# EasyEDA Pro project EasyEDA.epro, board PCB1
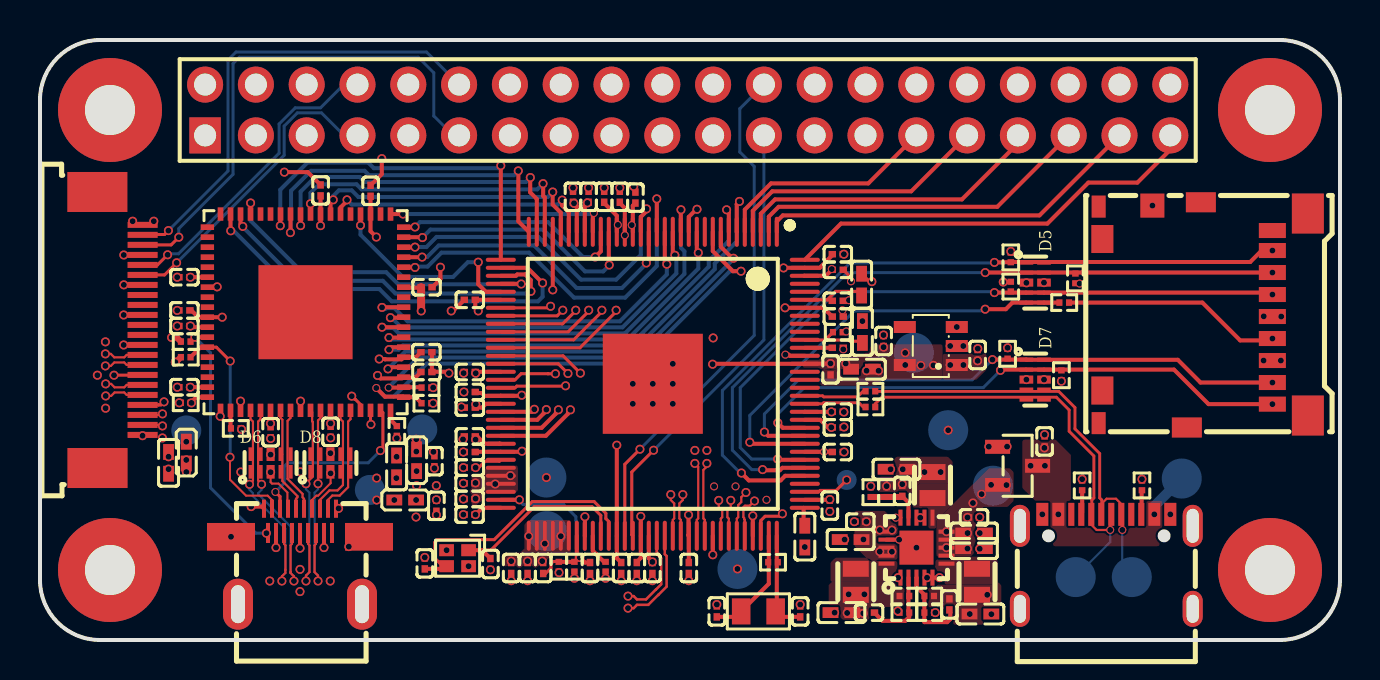
[diagram p3: board, top side]
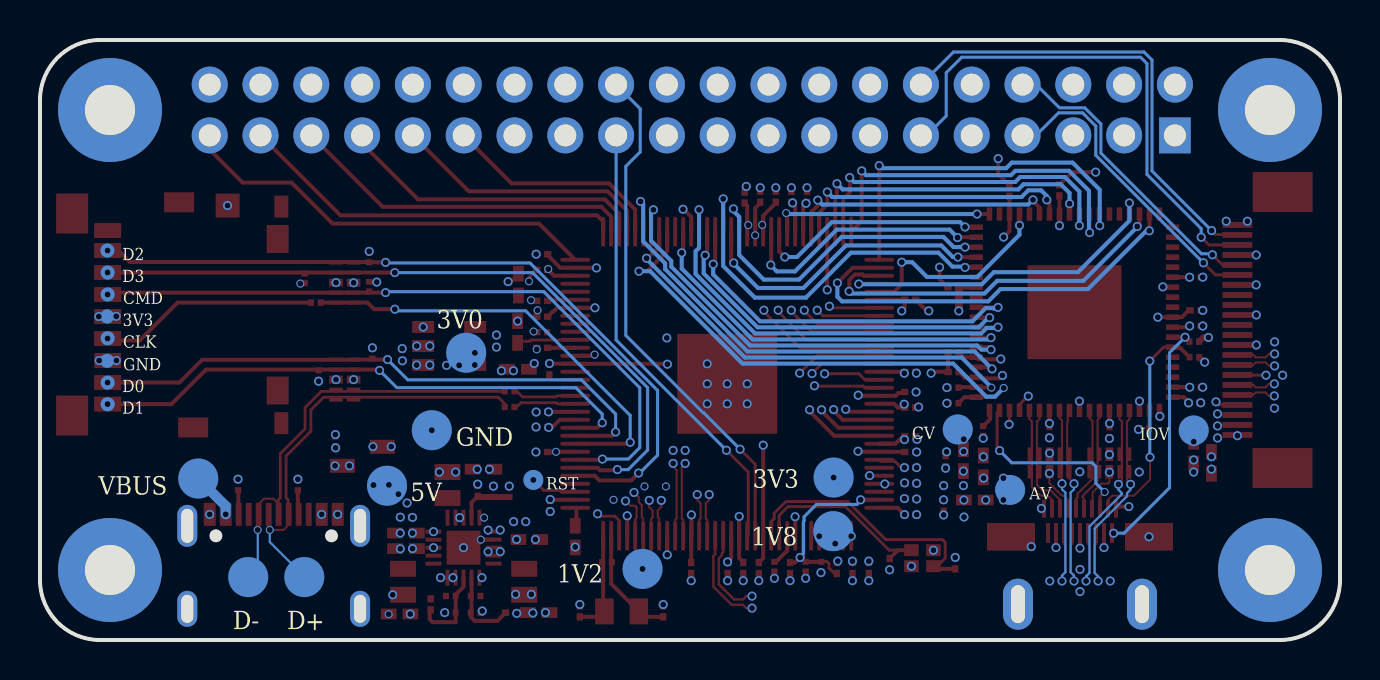
[diagram p4: board, bottom side, seen from below]

Outline 65 x 30 mm; copper layers: Top Layer, GND0, PWR, SIG, GND1, Bottom Layer. Coordinates in mm from the lower left corner of the outline.
Outline path: 0,27 0,3 arc(0.88,0.88) 3,0 62,0 arc(64.12,0.88) 65,3 65,27 arc(64.12,29.12) 62,30 3,30 arc(0.88,29.12) 0,27
Stack: Top Layer 0.035mm Outer layer thickness 1oz / Dielectric1 0.0994mm 3313 RC57% 4.2mil / GND0 0.0152mm Inner layer thickness / Dielectric2 0.55mm 0.55mm H/H No copper / PWR 0.0152mm Inner layer thickness / Dielectric3 0.1088mm 2116 RC54% 4.9mil / SIG 0.0152mm Inner layer thickness / Dielectric4 0.55mm 0.55mm H/H No copper / GND1 0.0152mm Inner layer thickness / Dielectric5 0.0994mm 3313 RC57% 4.2mil / Bottom Layer 0.035mm Outer layer thickness 1oz

## Design rules (mm)
net DP: DP2
net DM: DP2
net MCSI-CKN: DP10
net MCSI-CKP: DP10
net MCSI-D1N: DP8
net MCSI-D1P: DP8
net MCSI-D0N: DP9
net MCSI-D0P: DP9
net TXC-: DP7
net TXC+: DP7
net TX0-: DP6
net TX0+: DP6
net TX1-: DP5
net TX1+: DP5
net TX2-: DP4
net TX2+: DP4
net EPHY-TXP: DP12
net EPHY-TXN: DP12
net EPHY-RXP: DP11
net EPHY-RXN: DP11
net ESD_D+: DP3
net ESD_D-: DP3
template: Custom Config
spacing copperThickness1oz (default): track to track 0.102, other pairs 0.15 to 0.3
spacing copperThickness2oz: track to track 0.203, other pairs 0.152 to 0.3
track width copperThickness1oz (default): min 0.1, default 0.15, max 2.54
track width copperThickness2oz: min 0.203, default 0.254, max 2.54
differential pair differentialPair (default): width min 0.1, default 0.108, max 2.54; gap min 0.15, default 0.15
via viaSize (default): diameter min 0.4, default 0.45, max 10; hole min 0.3, default 0.3, max 6.3

## Placement (name value [footprint] x y rotation side)
1V2  -  [Test-Point-0.5mm]  34.87 3.55 180 bottom
1V8  -  [Test-Point-0.5mm]  25.34 5.44 180 bottom
3V0  -  [Test-Point-0.5mm]  43.69 14.36 180 bottom
3V3  -  [Test-Point-0.5mm]  25.32 8.12 180 bottom
3V3#2  -  [Test-Point-0.5mm#2]  61.64 16.18 180 bottom
5V  -  [Test-Point-0.5mm]  47.65 7.71 180 bottom
AV  -  [Test-Point-0.5mm#3]  16.49 7.5 180 bottom
C1  220pF  [C0201]  43.11 7.46 270 top
C2  10uF  [C0402]  42.82 8.54 180 top
C3  220pF  [C0201]  45.47 1.78 270 top
C4  10uF  [C0402]  47.02 1.3 0 top
C5  220pF  [C0201]  41.45 1.37 0 top
C6  10uF  [C0402]  40.07 1.37 180 top
C7  10uF  [C0402]  46.7 5.35 0 top
C8  10uF  [C0402]  46.7 4.57 0 top
C9  10uF  [C0402]  40.53 5.02 180 top
C10  1uF  [C0201]  41.01 5.92 180 top
C14  100nF  [C0201]  21.49 12.4 180 top
C15  100nF  [C0201]  21.49 9.4 180 top
C16  100nF  [C0201]  39.89 9.4 0 top
C17  100nF  [C0201]  39.89 19.29 0 top
C18  100nF  [C0201]  39.89 11.41 0 top
C19  100nF  [C0201]  39.89 16.17 0 top
C20  100nF  [C0201]  32.44 3.6 270 top
C21  100nF  [C0201]  39.49 6.72 270 top
C22  100nF  [C0201]  29.06 3.6 270 top
C23  100nF  [C0201]  28.99 22.16 90 top
C24  100nF  [C0201]  28.21 22.16 90 top
C25  100nF  [C0201]  27.43 22.16 90 top
C26  100nF  [C0201]  26.65 22.16 90 top
C27  100nF  [C0201]  21.49 13.4 180 top
C28  100nF  [C0201]  21.49 17.01 180 top
C29  100nF  [C0201]  21.49 11.62 180 top
C30  100nF  [C0201]  21.49 10.18 180 top
C31  100nF  [C0201]  21.48 6.27 180 top
C32  100nF  [C0201]  30.62 3.6 270 top
C33  100nF  [C0201]  21.49 8.62 180 top
C34  100nF  [C0201]  29.77 22.12 90 top
C37  100nF  [C0201]  39.89 18.51 0 top
C38  100nF  [C0201]  39.89 10.63 0 top
C39  100nF  [C0201]  21.48 7.83 180 top
C40  100nF  [C0201]  21.48 7.05 180 top
C41  100nF  [C0201]  23.56 3.6 270 top
C42  1uF  [C0201]  24.38 3.6 270 top
C43  1uF  [C0201]  29.84 3.6 270 top
C44  10uF  [C0402]  41.08 17.77 90 top
C45  100nF  [C0201]  39.89 16.96 0 top
C46  10uF  [C0402]  38.24 5.17 270 top
C47  10uF  [C0402]  41.1 13.54 0 top
C48  100nF  [C0201]  39.53 13.53 270 top
C49  10uF  [C0402]  41.12 15.4 90 top
C50  1uF  [C0201]  39.89 14.61 0 top
C51  100nF  [C0201]  25.16 3.6 270 top
C52  100nF  [C0201]  27.5 3.6 270 top
C53  15pF  [C0201]  22.52 3.8 90 top
C54  15pF  [C0201]  19.24 3.83 90 top
C55  15pF  [C0201]  38.01 1.43 90 top
C56  15pF  [C0201]  33.84 1.43 90 top
C58  100nF  [C0201]  50.23 9.93 90 top
C59  100nF  [C0201]  46.7 6.13 0 top
C60  100nF  [C0201]  11.53 10.39 270 top
C61  100nF  [C0201]  14.53 10.41 270 top
C62  100nF  [C0201]  19.32 14.39 0 top
C63  100nF  [C0201]  19.33 17.64 0 top
C64  100nF  [C0201]  14.03 22.48 90 top
C65  100nF  [C0201]  7.22 18.14 180 top
C66  100nF  [C0201]  7.22 15.7 180 top
C67  100nF  [C0201]  7.22 12.64 180 top
C68  100nF  [C0201]  19.32 13.4 0 top
C69  100nF  [C0201]  16.53 22.46 90 top
C70  100nF  [C0201]  7.22 16.48 180 top
C71  15pF  [C0201]  19.82 6.71 270 top
C72  10uF  [C0402]  17.83 8.68 90 top
C73  10uF  [C0402]  6.43 8.86 90 top
C74  15pF  [C0201]  19.72 8.94 90 top
C82  1uF  [C0201]  46.88 14.25 90 top
C83  1uF  [C0201]  42.18 14.95 90 top
CARD1  TF-110  [TF-SMD_TF-110]  58.16 16.26 90 top
CLK  -  [Test-Point-0.5mm#2]  61.62 15.09 180 bottom
CMD  -  [Test-Point-0.5mm#2]  61.62 17.28 180 bottom
CN1  HYC22-HDMID19-890  [HDMI-SMD_HYC22-HDMID19-890]  13 4.18 0 top
CV  -  [Test-Point-0.5mm#3]  19.11 10.53 180 bottom
D0  -  [Test-Point-0.5mm#2]  61.62 12.87 180 bottom
D1  -  [Test-Point-0.5mm#2]  61.62 11.79 180 bottom
D2  -  [Test-Point-0.5mm#2]  61.63 19.47 180 bottom
D3  -  [Test-Point-0.5mm#2]  61.62 18.37 180 bottom
D5  RClamp0524PATCT  [SLP2510P8_L2.5-W1.0-P0.50-BL]  49.76 17.87 270 top
D6  RClamp0524PATCT  [SLP2510P8_L2.5-W1.0-P0.50-BL]  11.53 8.85 0 top
D7  RClamp0524PATCT  [SLP2510P8_L2.5-W1.0-P0.50-BL]  49.76 13.02 270 top
D8  RClamp0524PATCT  [SLP2510P8_L2.5-W1.0-P0.50-BL]  14.52 8.85 0 top
D+  -  [Test-Point-0.5mm]  51.79 3.15 180 bottom
D-  -  [Test-Point-0.5mm]  54.59 3.15 180 bottom
GND  -  [Test-Point-0.5mm]  45.41 10.49 180 bottom
GND#2  -  [Test-Point-0.5mm#2]  61.64 13.96 180 bottom
H1  2.54mm 2*20P直排针  [HDR-TH_40P-P2.54-V-M-R2-C20-S2.54]  32.38 26.5 0 top
IOV  -  [Test-Point-0.5mm#3]  7.31 10.48 180 bottom
L1  2.2uH  [IND-SMD_L2.0-W1.2_FTC201210S]  44.62 7.75 270 top
L2  2.2uH  [IND-SMD_L2.0-W1.2_FTC201210S]  46.85 2.91 90 top
L3  2.2uH  [IND-SMD_L2.0-W1.2_FTC201210S]  40.79 2.91 90 top
L4  PBY100505T-101Y-N  [L0402]  18.26 7 180 top
L5  PBY100505T-101Y-N  [L0402]  7.31 9.37 90 top
L6  PBY100505T-101Y-N  [L0402]  18.83 8.99 90 top
P1  AFC07-S22FCC-00  [FPC-SMD_AFC07-S22FCC-00]  4 15.5 270 top
R1  68kΩ  [R0201]  42.33 7.39 90 top
R2  15kΩ  [R0201]  41.54 7.39 90 top
R3  200kΩ  [R0201]  44.46 2.2 0 top
R4  100kΩ  [R0201]  44.46 1.37 0 top
R5  100kΩ  [R0201]  43.22 2.2 180 top
R6  100kΩ  [R0201]  43.22 1.37 180 top
R8  240Ω  [R0201]  28.28 3.67 270 top
R9  200kΩ  [R0201]  39.89 15.39 180 top
R10  2kΩ  [R0201]  25.94 3.67 270 top
R11  2kΩ  [R0201]  26.72 3.67 90 top
R12  10MΩ  [R0201]  36.65 3.89 0 top
R13  47kΩ  [R0201]  48.54 19.13 90 top
R14  47kΩ  [R0201]  51.77 18.08 270 top
R15  47kΩ  [R0201]  48.54 17.67 90 top
R16  47kΩ  [R0201]  48.38 14.31 90 top
R17  47kΩ  [R0201]  51.07 13.24 270 top
R18  33Ω  [R0201]  51.21 16.87 180 top
R19  4.7kΩ  [R0201]  19.32 11.84 0 top
R20  4.7kΩ  [R0201]  19.32 12.62 0 top
R21  2.2kΩ  [R0201]  7.29 14.92 180 top
R22  2.2kΩ  [R0201]  7.29 14.14 180 top
R23  4.3kΩ  [R0201]  9.79 10.58 0 top
R24  10kΩ  [R0201]  7.29 11.86 180 top
R25  4.7kΩ  [R0201]  17.84 10.45 270 top
R26  5.1kΩ  [R0201]  52.11 7.73 270 top
R27  5.1kΩ  [R0201]  55.1 7.73 270 top
R36  22Ω  [R0201]  41.52 12.44 180 top
R37  22Ω  [R0201]  41.52 11.65 180 top
RST  -  [Test-Point-0.5mm#4]  40.33 8 180 bottom
SCREW1  -  [Screw-Hole-M2]  61.5 26.5 0 top
SCREW2  -  [Screw-Hole-M2]  3.5 26.5 0 top
SCREW3  -  [Screw-Hole-M2]  3.5 3.5 0 top
SCREW4  -  [Screw-Hole-M2]  61.5 3.5 0 top
U1  V3s  [LQFP-128_L14.0-W14.0-P0.40-LS16.0-BL-EP5.0]  30.64 12.81 180 top
U2  EA3036CQBR  [WQFN-20_L3.0-W3.0-P0.40-BL-EP]  43.82 4.62 0 top
U6  AP2337SA-7  [SOT-23-3_L2.9-W1.3-P1.90-LS2.4-BR]  48.88 8.71 180 top
U8  SII9022ACNU  [QFN-72_L10.0-W10.0-P0.50-BL-EP]  13.28 16.39 90 top
U9  LP5907MFX-3.0/NOPB  [SOT-23-5_L3.0-W1.7-P0.95-LS2.8-BR]  44.54 14.7 0 top
USB1  TYPE-C16PIN  [USB-C-SMD_TYPE-C16PIN]  53.32 3.92 0 top
VBUS  -  [Test-Point-0.5mm]  57.09 8.07 180 bottom
X3  32.768kHz  [FC-12M_L2.0-W1.2]  35.92 1.43 180 top
X4  24MHz  [CRYSTAL-SMD_4P-L1.6-W1.2-BL]  20.88 4.09 180 top

## Footprints (pads in the part's own frame, mm; a bottom-side part is the same pattern mirrored in y, then rotated)
C0201
  rect 0.368x0.324 smd: 1(-0.275,0) 2(0.275,0)
C0402
  rect 0.79x0.54 smd: 1(-0.545,0) 2(0.545,0)
CRYSTAL-SMD_4P-L1.6-W1.2-BL
  rect 0.73x0.6 smd: 1(-0.55,-0.4) 2(0.55,-0.4) 3(0.55,0.4) 4(-0.55,0.4)
FC-12M_L2.0-W1.2
  rect 0.925x1.3 smd: 1(-0.863,0) 2(0.863,0)
FPC-SMD_AFC07-S22FCC-00
  rect 0.3x1.5 smd: 1(5.245,1.129) 2(4.745,1.129) 3(4.245,1.129) 4(3.745,1.129) 5(3.245,1.129) 6(2.745,1.129) 7(2.245,1.129) 8(1.746,1.129) 9(1.246,1.129) 10(0.746,1.129) 11(0.245,1.129) 12(-0.255,1.129) 13(-0.754,1.129) 14(-1.254,1.129) 15(-1.75,1.13) 16(-2.253,1.129) 17(-2.754,1.129) 18(-3.253,1.129) 19(-3.753,1.129) 20(-4.256,1.132) 21(-4.756,1.132) 22(-5.256,1.132)
  rect 2x3 smd: 23(-6.901,-1.132) 24(6.901,-1.125)
HDMI-SMD_HYC22-HDMID19-890
  rect 0.2x0.9 smd: 1(1.8,2.388) 3(1.4,2.388) 5(1,2.388) 7(0.6,2.388) 9(0.2,2.388) 11(-0.2,2.388) 13(-0.6,2.388) 15(-1,2.388) 17(-1.4,2.388) 19(-1.8,2.388)
  rect 0.2x1 smd: 2(1.6,1.173) 4(1.2,1.173) 6(0.8,1.173) 8(0.4,1.173) 10(0,1.173) 12(-0.4,1.173) 14(-0.8,1.173) 16(-1.2,1.173) 18(-1.6,1.173)
  oval 1.5x2.55 hole 0.7x1.9: 20(-3.1,-2.388) 21(3.1,-2.388)
  rect 2.4x1.38 smd: 22(-3.45,0.983) 23(3.45,0.983)
HDR-TH_40P-P2.54-V-M-R2-C20-S2.54
  rect 1.575x1.8 hole 1.1: 1(-24.13,-1.27)
  round 1.8 hole 1.1: 2(-24.13,1.27) 3(-21.59,-1.27) 4(-21.59,1.27) 5(-19.05,-1.27) 6(-19.05,1.27) 7(-16.51,-1.27) 8(-16.51,1.27) 9(-13.97,-1.27) 10(-13.97,1.27) 11(-11.43,-1.27) 12(-11.43,1.27) 13(-8.89,-1.27) 14(-8.89,1.27) 15(-6.35,-1.27) 16(-6.35,1.27) 17(-3.81,-1.27) 18(-3.81,1.27) 19(-1.27,-1.27) 20(-1.27,1.27) 21(1.27,-1.27) 22(1.27,1.27) 23(3.81,-1.27) 24(3.81,1.27) 25(6.35,-1.27) 26(6.35,1.27) 27(8.89,-1.27) 28(8.89,1.27) 29(11.43,-1.27) 30(11.43,1.27) 31(13.97,-1.27) 32(13.97,1.27) 33(16.51,-1.27) 34(16.51,1.27) 35(19.05,-1.27) 36(19.05,1.27) 37(21.59,-1.27) 38(21.59,1.27) 39(24.13,-1.27) 40(24.13,1.27)
IND-SMD_L2.0-W1.2_FTC201210S
  rect 0.8x1.3 smd: 1(-0.65,0) 2(0.65,0)
L0402
  rect 0.79x0.54 smd: 1(-0.545,0) 2(0.545,0)
LQFP-128_L14.0-W14.0-P0.40-LS16.0-BL-EP5.0
  oval 0.2x1.5 smd: 1(-6.2,-7.599) 2(-5.8,-7.599) 3(-5.4,-7.599) 4(-5,-7.599) 5(-4.6,-7.599) 6(-4.2,-7.599) 7(-3.8,-7.599) 8(-3.4,-7.599) 9(-2.999,-7.599) 10(-2.6,-7.599) 11(-2.2,-7.599) 12(-1.8,-7.599) 13(-1.399,-7.599) 14(-1,-7.599) 15(-0.6,-7.599) 16(-0.2,-7.599) 17(0.2,-7.599) 18(0.6,-7.599) 19(1,-7.599) 20(1.399,-7.599) 21(1.8,-7.599) 22(2.2,-7.599) 23(2.6,-7.599) 24(2.999,-7.599) 25(3.4,-7.599) 26(3.8,-7.599) 27(4.2,-7.599) 28(4.6,-7.599) 29(5,-7.599) 30(5.4,-7.599) 31(5.8,-7.599) 32(6.2,-7.599) 65(6.2,7.599) 66(5.8,7.599) 67(5.4,7.599) 68(5,7.599) 69(4.6,7.599) 70(4.2,7.599) 71(3.8,7.599) 72(3.4,7.599) 73(2.999,7.599) 74(2.6,7.599) 75(2.2,7.599) 76(1.8,7.599) 77(1.399,7.599) 78(1,7.599) 79(0.6,7.599) 80(0.2,7.599) 81(-0.2,7.599) 82(-0.6,7.599) 83(-1,7.599) 84(-1.399,7.599) 85(-1.8,7.599) 86(-2.2,7.599) 87(-2.6,7.599) 88(-2.999,7.599) 89(-3.4,7.599) 90(-3.8,7.599) 91(-4.2,7.599) 92(-4.6,7.599) 93(-5,7.599) 94(-5.4,7.599) 95(-5.8,7.599) 96(-6.2,7.599)
  oval 1.5x0.2 smd: 33(7.599,-6.2) 34(7.599,-5.8) 35(7.599,-5.4) 36(7.599,-5) 37(7.599,-4.6) 38(7.599,-4.2) 39(7.599,-3.8) 40(7.599,-3.4) 41(7.599,-2.999) 42(7.599,-2.6) 43(7.599,-2.2) 44(7.599,-1.8) 45(7.599,-1.399) 46(7.599,-1) 47(7.599,-0.6) 48(7.599,-0.2) 49(7.599,0.2) 50(7.599,0.6) 51(7.599,1) 52(7.599,1.399) 53(7.599,1.8) 54(7.599,2.2) 55(7.599,2.6) 56(7.599,2.999) 57(7.599,3.4) 58(7.599,3.8) 59(7.599,4.2) 60(7.599,4.6) 61(7.599,5) 62(7.599,5.4) 63(7.599,5.8) 64(7.599,6.2) 97(-7.599,6.2) 98(-7.599,5.8) 99(-7.599,5.4) 100(-7.599,5) 101(-7.599,4.6) 102(-7.599,4.2) 103(-7.599,3.8) 104(-7.599,3.4) 105(-7.599,2.999) 106(-7.599,2.6) 107(-7.599,2.2) 108(-7.599,1.8) 109(-7.599,1.399) 110(-7.599,1) 111(-7.599,0.6) 112(-7.599,0.2) 113(-7.599,-0.2) 114(-7.599,-0.6) 115(-7.599,-1) 116(-7.599,-1.399) 117(-7.599,-1.8) 118(-7.599,-2.2) 119(-7.599,-2.6) 120(-7.599,-2.999) 121(-7.599,-3.4) 122(-7.599,-3.8) 123(-7.599,-4.2) 124(-7.599,-4.6) 125(-7.599,-5) 126(-7.599,-5.4) 127(-7.599,-5.8) 128(-7.599,-6.2)
  rect 5x5 smd: 129(0,0)
QFN-72_L10.0-W10.0-P0.50-BL-EP
  rect 0.28x0.665 smd: 1(-4.25,-4.907) 2(-3.75,-4.907) 3(-3.25,-4.907) 4(-2.75,-4.907) 5(-2.25,-4.907) 6(-1.75,-4.907) 7(-1.25,-4.907) 8(-0.75,-4.907) 9(-0.25,-4.907) 10(0.25,-4.907) 11(0.75,-4.907) 12(1.25,-4.907) 13(1.75,-4.907) 14(2.25,-4.907) 15(2.75,-4.907) 16(3.25,-4.907) 17(3.75,-4.907) 18(4.25,-4.907) 37(4.25,4.907) 38(3.75,4.907) 39(3.25,4.907) 40(2.75,4.907) 41(2.25,4.907) 42(1.75,4.907) 43(1.25,4.907) 44(0.75,4.907) 45(0.25,4.907) 46(-0.25,4.907) 47(-0.75,4.907) 48(-1.25,4.907) 49(-1.75,4.907) 50(-2.25,4.907) 51(-2.75,4.907) 52(-3.25,4.907) 53(-3.75,4.907) 54(-4.25,4.907)
  rect 0.665x0.28 smd: 19(4.907,-4.25) 20(4.907,-3.75) 21(4.907,-3.25) 22(4.907,-2.75) 23(4.907,-2.25) 24(4.907,-1.75) 25(4.907,-1.25) 26(4.907,-0.75) 27(4.907,-0.25) 28(4.907,0.25) 29(4.907,0.75) 30(4.907,1.25) 31(4.907,1.75) 32(4.907,2.25) 33(4.907,2.75) 34(4.907,3.25) 35(4.907,3.75) 36(4.907,4.25) 55(-4.907,4.25) 56(-4.907,3.75) 57(-4.907,3.25) 58(-4.907,2.75) 59(-4.907,2.25) 60(-4.907,1.75) 61(-4.907,1.25) 62(-4.907,0.75) 63(-4.907,0.25) 64(-4.907,-0.25) 65(-4.907,-0.75) 66(-4.907,-1.25) 67(-4.907,-1.75) 68(-4.907,-2.25) 69(-4.907,-2.75) 70(-4.907,-3.25) 71(-4.907,-3.75) 72(-4.907,-4.25)
  rect 4.7x4.7 smd: 73(0,0)
R0201
  rect 0.303x0.324 smd: 1(-0.241,0) 2(0.241,0)
Screw-Hole-M2
  round 5.2 hole 2.5: 1(0,0)
SLP2510P8_L2.5-W1.0-P0.50-BL
  rect 0.2x0.68 smd: 1(-1,-0.44) 2(-0.5,-0.44) 4(0.5,-0.44) 5(1,-0.44) 6(1,0.44) 7(0.5,0.44) 9(-0.5,0.44) 10(-1,0.44)
  rect 0.4x0.68 smd: 3(0.001,-0.44) 8(0.001,0.44)
SOT-23-3_L2.9-W1.3-P1.90-LS2.4-BR
  rect 1.25x0.7 smd: 1(1,-0.95) 2(1,0.95) 3(-1,0)
SOT-23-5_L3.0-W1.7-P0.95-LS2.8-BR
  rect 1.1x0.6 smd: 1(1.3,-0.95) 2(1.3,0) 3(1.3,0.95) 4(-1.3,0.95) 5(-1.3,-0.95)
Test-Point-0.5mm
  round 2 smd: 1(0,0)
Test-Point-0.5mm#2
  round 0.7 smd: 1(0,0)
Test-Point-0.5mm#3
  round 1.5 smd: 1(0,0)
Test-Point-0.5mm#4
  round 1 smd: 1(0,0)
TF-SMD_TF-110
  rect 0.75x1.35 smd: 1(3.217,-3.455) 2(2.118,-3.455) 3(1.018,-3.455) 4(-0.083,-3.455) 5(-1.183,-3.455) 6(-2.283,-3.455) 7(-3.382,-3.455) 8(-4.463,-3.455) 9(4.218,-3.455)
  rect 1.2x1.2 smd: 10(5.465,2.545)
  rect 1.1x0.7 smd: 11(5.414,5.23) 14(-5.413,5.23)
  rect 1.4x1.1 smd: 12(3.793,5.045) 13(-3.783,5.045)
  rect 1x1.5 smd: 15(-5.63,0.82) 18(5.63,0.12)
  rect 2x1.6 smd: 16(-5.032,-5.23) 17(5.067,-5.23)
USB-C-SMD_TYPE-C16PIN
  oval 1x2.1 hole 0.6x1.7: 1(-4.32,1.788) 2(4.32,1.788)
  oval 1x1.8 hole 0.6x1.4: 3(-4.32,-2.362) 4(4.32,-2.362)
  rect 0.6x1.15 smd: A1B12(-3.2,2.362) A4B9(-2.4,2.362) B1A12(3.2,2.362) B4A9(2.4,2.362)
  rect 0.3x1.15 smd: A5(-1.25,2.362) A6(-0.25,2.362) A7(0.25,2.362) A8(1.25,2.362) B5(1.75,2.362) B6(0.75,2.362) B7(-0.75,2.362) B8(-1.75,2.362)
WQFN-20_L3.0-W3.0-P0.40-BL-EP
  rect 0.2x0.8 smd: 1(-0.8,-1.5) 2(-0.4,-1.5) 3(0,-1.5) 4(0.4,-1.5) 5(0.8,-1.5) 11(0.8,1.5) 12(0.4,1.5) 13(0,1.5) 14(-0.4,1.5) 15(-0.8,1.5)
  rect 0.8x0.2 smd: 6(1.5,-0.8) 7(1.5,-0.4) 8(1.5,0) 9(1.5,0.4) 10(1.5,0.8) 16(-1.5,0.8) 17(-1.5,0.4) 18(-1.5,0.001) 19(-1.5,-0.4) 20(-1.5,-0.8)
  rect 1.7x1.7 smd: 21(0,0)

## Nets
As in the schematic, except:
3V3: 3V3.1 3V3#2.1 C1.1 C2.1 C14.1 C15.1 C16.1 C17.1 C18.1 C19.1 C20.1 C21.1 C73.1 C82.1 CARD1.4 H1.5 H1.16 H1.34 H1.36 L1.1 L5.1 P1.22 R1.2 R13.2 R14.2 R15.2 R16.2 R17.2 R19.2 R20.2 R21.2 R22.2 U1.12 U1.29 U1.50 U1.57 U1.85 U1.93 U1.98 U1.104 U1.109 U1.122 U1.127 U9.1 U9.3
GND: C2.2 C4.2 C6.2 C7.2 C8.2 C9.2 C10.2 C14.2 C15.2 C16.2 C17.2 C18.2 C19.2 C20.2 C21.2 C22.2 C23.2 C24.2 C25.2 C26.2 C27.2 C28.2 C29.2 C30.2 C31.2 C32.2 C33.2 C34.2 C37.2 C38.2 C39.2 C40.2 C41.2 C42.2 C43.2 C44.2 C45.2 C46.2 C47.2 C48.2 C49.2 C50.2 C52.2 C53.1 C54.2 C55.2 C56.2 C58.2 C59.2 C60.2 C61.2 C62.2 C63.2 C64.2 C65.2 C66.2 C67.2 C68.2 C69.2 C70.2 C71.2 C72.2 C73.2 C74.2 C82.2 C83.2 CARD1.6 CARD1.10 CN1.4 CN1.7 CN1.10 CN1.13 CN1.16 CN1.20 CN1.21 CN1.22 CN1.23 D5.3 D5.8 D6.3 D6.8 D7.3 D7.8 D8.3 D8.8 GND.1 GND#2.1 H1.2 H1.4 H1.6 H1.15 H1.32 H1.38 P1.1 P1.4 P1.7 P1.10 P1.13 P1.16 P1.19 R2.2 R4.2 R6.2 R8.2 R9.1 R11.1 R23.2 R24.2 R25.2 R26.1 R27.1 U1.116 U1.129 U2.1 U2.4 U2.5 U2.12 U2.13 U2.15 U2.17 U2.21 U6.1 U8.43 U8.55 U8.57 U8.63 U8.69 U8.70 U8.73 U9.2 USB1.1 USB1.2 USB1.3 USB1.4 USB1.A1B12 USB1.B1A12 X4.2 X4.4

Pads without a net: CARD1 9 11 12 13 14 15 16 17 18; CN1 2; P1 11 12 14 15 23 24; SCREW1 1; SCREW2 1; SCREW3 1; SCREW4 1; U1 10 112 113 114 119 120 121 124 125; U8 11 13 20 23 31 32 36 37 38 39 40 41 44 45 50; U9 4; USB1 A8 B8

## Via types
v1: diameter 0.45, hole 0.3, Top Layer to Bottom Layer, 372 vias
v2: diameter 0.4, hole 0.3, Top Layer to Bottom Layer, 24 vias

## Routing (per net, layer and track width the routed paths; a pad name or vN(x,y) marks a point on that pad's centre or on a via; arc(x,y) is an arc through that point)
1V2: length 21.8
  Top Layer w0.15: v1(21.78,8.62) 21.94,8.62 22.25,8.94 22.97,8.94 U1.58
  Top Layer w0.2: U1.56 22.98,9.81 22.97,9.82 22.22,9.82 21.9,10.14 21.8,10.14 C30.1 ; 28.99,21.85 29.24,21.59 U1.20 ; v1(21.91,16.45) 21.76,16.6 C28.1 U1.38 ; U1.51 22.29,11.81 22.1,11.62 C29.1 ; U1.21 28.84,21.22 28.21,21.85 ; 39.58,18.5 39.3,18.21 38.22,18.21 38.21,18.22 ; v1(26.7,21.84) 26.84,21.7 U1.26 ; C34.1 29.64,21.72 U1.19 ; U1.64 22.11,6.61 v1(21.77,6.27) ; U1.25 27.24,21.73 v1(27.37,21.86) ; v1(30.62,3.9) 30.44,4.08 U1.80 ; U1.108 39.01,11.01 39.39,10.63 v1(39.57,10.63) ; v1(21.78,13.34) 21.85,13.41 U1.47 ; U1.88 v1(33.64,4.26)
  vias: v1(18.83,8.44) v1(18.83,7.72) v1(18.81,7) v1(18.8,6.15) v1(19.72,8.59) v1(19.82,7.72) v1(19.82,7.01) v1(21.79,11.79) v1(21.78,10.02) v1(34.87,3.55) v1(40.43,2.28) v1(40.36,1.35) v1(41.22,2.28) v1(41.16,1.33) v2(28.89,20.75) v2(29.24,20.24) v2(29.59,20.75) v2(39.59,18.55)
1V8: length 3.3
  Top Layer w0.2: v1(27.25,6.16) 27.25,5.22 U1.72 ; 29.84,3.9 30.04,4.1 U1.79 v1(30.04,6.18)
  vias: v1(21.77,7.86) v1(21.78,7.07) v1(22.76,7.8) v1(23.52,8.22) v1(23.56,3.94) v1(24.44,5.19) v1(24.38,3.94) v1(25.11,3.94) v1(25.24,4.82) v1(26.04,5.19) v1(25.95,3.37) v1(46.49,1.3) v1(47.36,2.26)
3V0: length 12.7
  Top Layer w0.2: 39.51,13.83 39.52,13.82 38.25,13.82 U1.115 33.65,13.81 v1(33.63,13.79) ; C22.1 28.84,4.09 U1.76 v1(28.84,9.74) ; v1(40.29,13.83) 40.31,13.8
  PWR w0.2: v1(40.29,13.83) v1(39.53,13.83)
  vias: v1(33.66,15.1) v1(42.18,14.64) v1(43.26,14.36) v1(43.26,13.75) v1(44.04,13.73) v1(44.67,13.73)
3V3: length 26.8
  Top Layer w0.2: C19.1 39.35,16.44 39.31,16.44 39.14,16.61 U1.122 v1(37.25,16.61) ; U1.12 32.44,21.16 32.82,21.54 v1(32.85,21.54) ; C14.1 21.81,12.35 22.08,12.35 22.22,12.21 23.04,12.21 U1.50 24.06,12.21 v1(24.09,12.24) ; 39.6,19.31 39.64,19.27 38.99,18.61 U1.127 37.18,18.61 v1(37.18,18.6) ; U1.109 38.24,11.41 v1(39.57,11.41) 39.58,11.41 C18.1 ; C20.1 U1.85 32.41,5.24 32.42,5.25 32.42,6.25 v1(32.43,6.26) ; 39.49,7.03 39.47,7.01 ; 39.47,7.01 C21.1 ; 39.47,7.01 U1.98 ; R15.2 48.53,17.9 v1(48.16,17.9) ; C15.1 21.77,9.41 U1.57 24.07,9.41 v1(24.1,9.44) ; U1.93 v1(35.64,6.21) ; U1.104 v2(39.2,9.41) 39.61,9.41 C16.1 ; 25.64,20.41 v1(25.64,17.51)
  Top Layer w0.299: R22.2 6.8,13.89 v1(6.77,13.89) ; v1(6.58,15.13) 6.84,15.13 R21.2
  Top Layer w0.399: 46.88,13.97 v1(46.88,13.96)
  PWR w0.2: 32.74,21.5 32.41,21.17 32.41,19.91 ; v1(39.57,11.41) 37.54,11.41
  vias: v1(4.63,20.94) v1(5.69,20.94) v1(6.43,8.54) v1(7.31,9) v1(7.32,8.4) v1(19.66,12.62) v1(19.66,11.84) v1(25.32,8.12) v1(39.49,7.03) v1(42.33,7.69) v1(43.14,8.54) v1(43.11,7.79) v1(44.22,8.4) v1(45.03,8.4) v1(45.51,13.75) v1(45.84,15.65) v1(46.17,13.75) v1(48.38,14.61) v1(48.54,19.43) v1(51.07,12.94) v1(61.19,16.18) v1(62.06,16.17) v2(51.98,17.82)
+5V: length 0.7
  Top Layer w0.2: CN1.19 11.1,6.67 v1(10.56,6.67)
  vias: v1(41.17,5.03) v1(41.32,5.92) v1(41.99,5.5) v1(41.99,4.42) v1(42.6,5.49) v1(42.6,4.41) v1(45.32,5.42) v1(45.32,4.62) v1(46.38,6.13) v1(46.38,5.35) v1(46.37,4.57) v1(46.65,6.85) v1(47.08,7.29) v1(47.55,7.76) v1(48.32,7.75)
AVCC12: length 1.7
  Top Layer w0.2: 14.53,10.61 14.53,11.48 U8.66 ; U8.60 11.53,10.64 11.54,10.62
  vias: v1(11.53,10.83) v1(14.53,10.83) v1(16.83,8.09) v1(16.83,7) v1(17.72,7) v1(17.82,8.09)
GND: length 26.4
  Top Layer w0.1: v1(14.53,8.33) 14.53,7.84 13.91,7.22 13.82,7.22 13.6,7 CN1.7 ; CN1.13 12.37,6.6 12.37,7.38 11.93,7.82 11.6,7.82 11.53,7.89 D6.3
  Top Layer w0.15: C37.2 40.55,18.13 v2(40.55,17.93) ; U8.70 16.53,10.8 v1(16.55,10.78) ; v1(41.59,17.92) 41.48,17.92 C44.2 ; v1(6.2,11.91) 6.05,11.76 5.94,11.76 5.93,11.75 P1.4 ; v1(3.7,13.24) 5.11,13.24 P1.7 ; U8.69 16.03,11.78 15.76,12.04 15.74,12.04 v1(15.59,12.19)
  Top Layer w0.2: C39.2 v1(21.17,7.83) ; v1(44.35,3.12) U2.5 v1(44.97,3.12) ; v1(20.45,13.34) 20.38,13.41 19.64,13.41 ; D5.3 v1(49.32,17.86) ; 42.32,5.02 v2(42.96,5.02) ; v1(4.19,17.76) 5.13,17.76 P1.16 ; v1(17.09,24.07) 17.09,23.29 C69.2 ; v1(14.2,4.62) CN1.4 ; v1(12.22,23.39) 13.39,23.39 C64.2 ; v1(21.18,13.34) 21.18,13.37 C27.2 ; v2(37.27,14.27) 37.44,14.27 37.49,14.21 U1.116 ; P1.19 4.19,19.25 v1(4.19,19.25) ; v1(20.02,18.64) 20.02,18.05 19.57,17.6 ; v1(4.18,16.25) 4.19,16.25 P1.13 ; v2(42.79,6.12) U2.15 ; v1(11.8,4.62) CN1.16 ; P1.10 5.13,14.75 v1(4.18,14.75) ; 21.18,8.62 C33.2 ; C62.2 C68.2 ; CN1.10 v1(13,4.59)
  Top Layer w0.201: C28.2 20.66,16.45 v1(20.56,16.45)
  vias: v1(2.87,13.24) v1(3.27,14.91) v1(3.28,11.59) v1(5.13,10.22) v1(6.12,10.1) v1(6.43,9.16) v1(6.86,18.14) v1(6.86,16.48) v1(6.86,15.7) v1(6.87,12.64) v1(6.96,11.86) v1(8.86,17.66) v1(9.01,11.18) v1(9.55,5.16) v1(10.03,11.94) v1(10.04,8.4) v1(10.08,10.53) v1(11.53,10.08) v1(11.53,9.27) v1(11.53,8.39) v1(11.49,2.95) v1(13.03,11.94) v1(13.01,8.41) v1(13,3.53) v1(13,2.42) v1(14.53,10.11) v1(14.52,9.34) v1(14.51,2.95) v1(15.44,4.67) v1(17.84,10.09) v1(17.83,9.16) v1(19.24,4.13) v1(19.67,9.41) v1(19.82,6.25) v1(20.33,4.49) v1(21.07,11.65) v1(21.2,12.4) v1(21.15,10.03) v1(21.17,9.4) v1(21.17,8.62) v1(21.17,7.05) v1(21.17,6.27) v1(21.43,3.69) v1(22.52,3.51) v1(23.56,2.97) v1(24.38,2.97) v1(26.65,22.61) v1(26.72,3.09) v1(27.43,22.61) v1(27.5,2.97) v1(28.21,22.61) v1(28.28,3.09) v1(28.99,22.61) v1(29.06,2.97) v1(29.64,12.81) v1(29.64,11.81) v1(29.69,22.68) v1(29.84,2.97) v1(30.64,12.81) v1(30.64,11.81) v1(30.62,2.97) v1(31.64,13.81) v1(31.64,12.81) v1(31.64,11.81) v1(32.44,2.97) v1(32.74,9.48) v1(33.34,9.48) v1(33.84,1.77) v1(38.01,1.77) v1(38.24,4.65) v1(39.49,6.43) v1(39.73,1.37) v1(40.19,19.29) v1(40.19,11.4) v1(40.2,10.65) v1(40.2,9.4) v1(40.23,5.02) v1(40.71,5.92) v1(41.12,15.94) v1(41.33,13.46) v1(41.54,7.69) v1(41.93,13.46) v1(42.18,15.25) v1(42.53,8.54) v1(42.9,3.12) v1(42.89,1.45) v1(43.82,4.62) v1(44.01,6.12) v1(44.76,1.37) v1(45.41,10.49) v1(45.51,14.7) v1(46.16,14.7) v1(46.89,14.57) v1(46.99,6.14) v1(46.99,5.35) v1(46.99,4.56) v1(47.44,9.67) v1(48.35,9.67) v1(49.32,13.02) v1(50.12,6.28) v1(50.2,17.87) v1(50.2,13.02) v1(50.23,10.27) v1(52.11,8.04) v1(55.1,8.04) v1(55.62,21.72) v1(56.52,6.28) v1(61.18,13.97) v1(62.04,13.97) v2(33.7,7.68) v2(34.78,7.68) v2(36.32,7.01) v2(40.12,16.49) v2(40.16,14.53) v2(40.32,15.43) v2(40.45,16.99) v2(47.57,1.29)
VBUS: length 2.4
  Bottom Layer w0.5: VBUS.1 55.72,6.7 v1(55.72,6.28)
  vias: v1(49.53,8.71) v1(50.22,9.61) v1(50.25,8.71) v1(50.92,6.28)
CAM_IO0: length 37.8
  Top Layer w0.15: v1(6.83,18.86) 6.23,18.25 P1.17
  Top Layer w0.2: v1(25.32,11.52) 25.19,11.39 25.19,11.34 24.86,11.01 U1.53
  SIG w0.15: H1.7 16.03,25.07 16.03,23.34 17.7,21.68 17.7,21.49 17.7,21.48 17.7,21.11 17.7,21.11 17.7,17.17 20.51,14.37 21.91,14.37 22.54,13.74 22.54,12.42 23.18,11.78 24.32,11.78 24.53,11.99 25.05,11.99 25.33,11.71 25.33,11.53 v1(25.32,11.52)
  Bottom Layer w0.15: v1(6.83,18.86) 12.21,24.24 12.21,25.7 12.87,26.36 14.07,26.36 15.2,25.23 H1.7
CAM_IO1: length 40.1
  Top Layer w0.15: v1(6.38,19.26) 5.87,18.75 P1.18
  Top Layer w0.2: v1(24.72,11.54) 24.59,11.41 U1.52
  SIG w0.15: H1.8 15.78,27.68 15.55,27.68 14.65,26.78 14.65,24.13 17.29,21.49 17.29,17.08 20.39,13.98 21.78,13.98 22.24,13.53 22.24,12.13 22.92,11.45 24.52,11.45 24.52,11.45 24.63,11.45 v1(24.72,11.54)
  Bottom Layer w0.15: H1.8 15.19,27.77 14.03,26.61 12.76,26.61 11.96,25.8 11.96,24.34 6.93,19.31 6.43,19.31 v1(6.38,19.26)
CAM_SCL: length 43.8
  Top Layer w0.15: v1(6.94,20.14) 6.56,19.76 P1.20 ; v1(25.77,13.31) 25.4,13.31 25.4,13.32 24.06,13.32 23.75,13.01 U1.48
  SIG w0.15: 20.96,25.23 21.51,24.67 21.51,19.44 21.36,19.29 21.36,16.37 21.87,15.86 23.22,15.86 v1(25.77,13.31)
  Bottom Layer w0.15: 20.96,25.23 20.66,25.23 19.69,26.2 19.69,28.36 18.91,29.14 9.97,29.14 9.65,28.82 9.65,23.28 6.94,20.57 v1(6.94,20.14)
CAM_SDA: length 46.3
  Top Layer w0.15: v1(26.28,12.71) 26.26,12.69 23.84,12.69 23.75,12.61 U1.49 ; 5.02,20.28 6.23,20.28 v1(6.42,20.47)
  SIG w0.15: 20.96,27.77 19.61,26.42 19.61,22.1 21.04,20.67 21.04,16.17 21.7,15.51 22.93,15.51 25.73,12.71 v1(26.28,12.71)
  Bottom Layer w0.15: v1(6.42,20.47) 9.4,23.45 9.4,29 9.8,29.4 19.32,29.4 20.96,27.77
CEC: length 9.6
  Top Layer w0.15: CN1.15 12,7.17 v2(11.77,7.4) ; v1(17.02,9.47) 17.14,9.59 17.14,11.36 U8.71
  Bottom Layer w0.15: v1(17.02,9.47) 16.41,8.86 12.39,8.86 12.21,8.68 12.21,7.84 v2(11.77,7.4)
CLK: length 11
  Top Layer w0.2: v1(61.62,15.07) 61.53,14.98 60.01,14.98 58.12,16.87 R18.1
CVCC12: length 8.3
  Top Layer w0.2: C64.1 14.03,22.2 U8.26 v1(14.03,20.72) ; 18.98,17.63 18.97,17.61 18.15,17.61 ; U8.47 7.58,15.64 v1(7.52,15.7) ; C62.1 18.8,14.14 U8.5 18.08,14.03 17.25,14.03 17.24,14.05 v1(16.96,14.05) ; v1(7.51,12.64) U8.53 ; v1(7.52,18.14) U8.42
  Top Layer w0.399: v1(19.06,16.45) 19.06,16.46 C63.1
  vias: v1(18.81,10.04) v1(18.82,9.42)
DM: length 3.2
  Top Layer w0.141: R37.2 41.16,11.65 40.94,11.86 39.19,11.86 39.13,11.81 U1.110
DP: length 3.2
  Top Layer w0.141: U1.111 39.13,12.21 39.19,12.16 40.87,12.16 41.16,12.44 R36.2
DSCL: length 11
  Top Layer w0.1: v1(9.5,9.14) 9.5,8.02 10.3,7.22 11.38,7.22 11.6,7 CN1.17
  Top Layer w0.15: U8.49 8.82,14.64 v1(9.51,13.95)
  Top Layer w0.2: 8.03,14.64 R22.1
  Bottom Layer w0.15: v1(9.51,13.95) 9.51,9.15 v1(9.5,9.14)
DSDA: length 12.5
  Top Layer w0.2: U8.48 v1(7.75,15.14) R21.1
  Bottom Layer w0.15: v1(11.32,5.34) 10.8,5.34 8.52,7.61 8.52,14.36 v1(7.75,15.14)
EPHY-RTX: length 26.2
  Top Layer w0.15: U1.94 36.04,5.97 36.26,6.19 37,6.19 v1(37.12,6.31)
  SIG w0.108: v1(37.12,6.31) 37.12,7.33 38.78,8.99 38.78,18.78 42.58,22.58 42.58,26.53 H1.30
EPHY-RXN: length 25.2
  Top Layer w0.108: U1.89 34.04,6.07 34.11,6.14 34.11,6.47 33.94,6.65 v1(33.94,6.98)
  SIG w0.108: 38.74,27.77 38.74,26.71 38.63,26.6 37.64,26.6 37.3,26.26 37.3,20.08 35.22,18 35.22,10.59 34.11,9.48 34.11,7.48 33.94,7.31 v1(33.94,6.98)
EPHY-RXP: length 24.8
  Top Layer w0.108: U1.90 34.44,6.07 34.37,6.14 34.37,6.47 34.54,6.64 v1(34.54,6.98)
  SIG w0.108: 38.74,25.23 38.74,26.29 38.69,26.34 37.75,26.34 37.56,26.15 37.56,19.97 35.48,17.89 35.48,10.48 34.37,9.37 34.37,7.49 34.54,7.32 v1(34.54,6.98)
EPHY-TXN: length 26.5
  Top Layer w0.108: v1(35.3,7.38) 35.06,7.14 35.06,6.9 34.91,6.75 34.91,6.14 34.84,6.07 U1.91
  SIG w0.108: v1(35.3,7.38) 35.53,7.61 35.78,7.61 35.93,7.76 36.6,7.76 37.73,8.9 37.73,19.15 39.88,21.3 39.88,26.23 40.3,26.65 41.12,26.65 41.12,27.36 40.94,27.54 41.17,27.77 41.28,27.77
EPHY-TXP: length 26.1
  Top Layer w0.108: U1.92 35.24,6 35.21,6.03 35.21,6.1 35.17,6.14 35.17,6.64 35.25,6.72 35.49,6.72 v1(35.72,6.95)
  SIG w0.108: 41.28,25.23 41.17,25.23 40.94,25.46 41.12,25.64 41.12,26.39 40.41,26.39 40.14,26.12 40.14,21.19 37.99,19.04 37.99,8.79 36.71,7.51 36.04,7.51 35.96,7.43 35.96,7.19 v1(35.72,6.95)
EPHY_LINK_LED: length 26
  Top Layer w0.15: U1.77 29.24,8.78 v1(30,9.54)
  Bottom Layer w0.15: H1.24 34.99,26.56 34.99,24.4 35.71,23.68 35.71,15.23 31.84,11.36 31.81,11.36 v1(30,9.54)
EPHY_SPD_LED: length 22.8
  Top Layer w0.15: v1(30.68,9.49) 29.59,8.4 29.59,5.26 U1.78
  Bottom Layer w0.15: H1.23 36.19,15 v1(30.68,9.49)
ESD_D+: length 21.5
  Top Layer w0.108: USB1.A7 53.51,6.23 v2(53.51,5.5) ; USB1.B7 52.56,6.28 52.56,5.77 52.83,5.5 53.51,5.5
  Top Layer w0.141: 52.59,6.28 52.59,7 52.69,7.1 52.69,9.2 51.46,10.44 51.46,11.5 50.82,12.14 42.09,12.14 41.76,11.81 R37.1
  Bottom Layer w0.108: 51.73,3.27 51.88,3.27 53.51,4.9 v2(53.51,5.5)
ESD_D-: length 20.8
  Top Layer w0.108: v2(54.12,5.5) 54.12,6.75 53.8,7.06 53.33,7.06 53.09,6.82 ; 53.09,6.28 USB1.A6
  Top Layer w0.141: 53.09,6.28 53.09,7 52.99,7.1 52.99,9.32 51.75,10.56 51.75,11.62 50.94,12.43 41.77,12.43 R36.1
  Bottom Layer w0.108: v2(54.12,5.5) 54.11,5.5 54.11,3.67 54.28,3.51
HPD: length 12.1
  Top Layer w0.15: U8.54 8.39,12.12
  Top Layer w0.2: R24.1 7.81,12.14 U8.54
  SIG w0.15: 7.6,11.91 8.09,12.39 10.6,12.39 14.14,8.85 14.65,8.85 14.98,8.52 14.98,6.63 v1(14.93,6.58)
  vias: v1(7.57,11.86)
IOVCC: length 6.3
  Top Layer w0.2: 18.1,13.11 18.76,13.11 19.05,13.4 ; v1(9.11,16.14) U8.46 7.91,16.14 7.57,16.48 C70.1 ; 18.1,13.08 17.03,13.08 v1(16.88,13.23) ; v1(16.82,20.15) 16.53,20.44 U8.21 16.53,22.18 C69.1
  vias: v1(7.31,9.91)
LCD_CLK: length 10.5
  Top Layer w0.2: U1.37 22.29,17.41 21.91,17.79 v1(21.91,18.89) ; v1(16.03,20.73) U8.22
  Bottom Layer w0.2: v1(21.91,18.89) 21.39,18.89 20.65,18.15 18.14,18.15 16.03,20.26 v1(16.03,20.73)
LCD_D2: length 18.8
  Top Layer w0.2: U8.30 12.01,21.29 v1(12.01,20.72) ; U1.33 v1(23.04,23.72)
  Bottom Layer w0.2: v1(23.04,23.72) 22.91,23.59 16.69,23.59 16.41,23.87 13.37,23.87 12.01,22.51 v1(12.01,20.72)
LCD_D3: length 18.3
  Top Layer w0.2: v1(12.52,20.37) 12.53,20.38 U8.29 ; v1(23.91,23.46) 23.92,23.45 23.92,20.93 U1.32
  Bottom Layer w0.2: v1(23.91,23.46) 23.7,23.24 16.45,23.24 16.23,23.46 13.55,23.46 12.55,22.46 12.55,20.4 v1(12.52,20.37)
LCD_D4: length 17.1
  Top Layer w0.2: U8.28 13.03,21.29 v1(13.03,20.72) ; v1(24.52,23.12) 24.51,23.12 24.51,22.38 24.84,22.05 U1.31
  Bottom Layer w0.2: v1(13.03,20.72) 13.03,22.42 13.76,23.15 15.99,23.15 16.24,22.9 24.29,22.9 v1(24.52,23.12)
LCD_D5: length 15.5
  Top Layer w0.2: U8.27 13.52,21.3 v1(13.52,21.81) ; U1.30 25.24,22.12 25.16,22.2 25.16,22.81 v1(25.15,22.82)
  Bottom Layer w0.2: v1(25.15,22.82) 24.86,22.53 16.08,22.53 15.82,22.79 13.96,22.79 13.52,22.35 v1(13.52,21.81)
LCD_D6: length 14.4
  Top Layer w0.2: 25.63,22.4 25.63,21.77 26.04,21.37 U1.28 ; U8.25 14.53,21.88 v1(14.66,22.01)
  Bottom Layer w0.2: v1(25.63,22.4) 25.38,22.15 15.92,22.15 15.59,22.48 14.94,22.48 14.66,22.2 v1(14.66,22.01)
LCD_D7: length 13.5
  Top Layer w0.2: U8.24 15.03,21.63 15.35,21.95 v1(15.35,22.01) ; U1.27 26.44,21.41 26.4,21.45 26.38,21.45 26.11,21.72 v1(26.11,21.99)
  Bottom Layer w0.2: v1(15.35,22.01) 15.58,21.77 25.89,21.77 v1(26.11,21.99)
LCD_D10: length 11.1
  Top Layer w0.2: U8.19 v1(18.15,21.3) ; U1.24 27.64,21.3 v2(27.69,21.35)
  Bottom Layer w0.2: v2(27.69,21.35) 27.64,21.3 v1(18.15,21.3)
LCD_D11: length 11.8
  Top Layer w0.2: v1(18.75,20.65) 18.74,20.64 U8.18 ; v1(27.76,19.15) 28.04,19.43 U1.23
  Bottom Layer w0.2: v1(27.76,19.15) 27.15,19.15 25.41,20.89 18.99,20.89 v1(18.75,20.65)
LCD_D12: length 13.1
  Top Layer w0.2: U1.22 28.44,18.77 v1(28.46,18.75) ; U8.17 19.11,20.14 v1(19.12,20.12)
  Bottom Layer w0.2: v1(19.12,20.12) 19.52,20.52 25.16,20.52 27.25,18.43 28.16,18.43 28.46,18.73 v1(28.46,18.75)
LCD_D13: length 17.2
  Top Layer w0.2: U8.16 18.75,19.64 18.75,19.64 ; U1.18 30.04,21.16 30.33,21.45 v1(30.33,21.56)
  Bottom Layer w0.2: v1(18.75,19.64) 18.77,19.67 18.9,19.67 18.93,19.65 19.32,19.65 19.83,20.15 24.92,20.15 27.05,18.02 28.81,18.02 30.04,19.25 30.04,21.16 30.33,21.45 v1(30.33,21.56)
LCD_D14: length 15.4
  Top Layer w0.2: v1(30.32,18.85) 30.44,18.98 U1.17 ; v1(19.11,19.15) 19.1,19.14 U8.15
  Bottom Layer w0.2: v1(19.11,19.15) 19.35,19.15 19.93,19.73 24.7,19.73 26.83,17.6 29.1,17.6 30.32,18.82 v1(30.32,18.85)
LCD_D15: length 19.6
  Top Layer w0.2: v1(18.75,18.63) 18.74,18.64 U8.14 ; U1.16 v1(30.84,22.06)
  Bottom Layer w0.2: v1(18.75,18.63) 18.79,18.67 19.38,18.67 20.07,19.37 24.45,19.37 26.7,17.12 29.26,17.12 30.84,18.7 v1(30.84,22.06)
LCD_D18: length 18.8
  Top Layer w0.2: v1(31.34,18.79) 31.24,18.89 U1.15 ; U8.10 17.11,16.64 v1(17.1,16.63)
  Bottom Layer w0.2: v1(17.1,16.63) 17.1,16.62 17.15,16.57 17.3,16.57 17.32,16.59 17.72,16.59 18.38,15.93 29,15.93 31.34,18.28 v1(31.34,18.79)
LCD_D19: length 18.4
  Top Layer w0.2: U8.9 18.16,16.12 v1(17.52,16.12) ; U1.14 31.64,19.34 v1(31.74,19.24)
  Bottom Layer w0.2: v1(17.52,16.12) 17.58,16.12 18.06,15.63 29.12,15.63 31.82,18.33 31.82,19.16 v1(31.74,19.24)
LCD_D20: length 22
  Top Layer w0.2: U8.8 v1(17.1,15.64) ; U1.13 32.04,21.5 v1(32.05,21.51)
  Bottom Layer w0.2: v1(32.05,21.51) 32.05,19.61 32.22,19.43 32.22,18.3 29.25,15.33 17.94,15.33 17.67,15.6 17.14,15.6 v1(17.1,15.64)
LCD_D21: length 19.6
  Top Layer w0.2: v1(32.91,19.36) 32.84,19.44 U1.11 ; U8.7 18.16,15.12 v1(17.45,15.12)
  Bottom Layer w0.2: v1(32.91,19.36) 32.91,18.57 29.37,15.03 17.54,15.03 v1(17.45,15.12)
LCD_D22: length 22.9
  Top Layer w0.2: v1(17.45,14.52) 17.57,14.64 U8.6 ; U1.7 34.44,21.38 34.33,21.49
  Bottom Layer w0.2: v1(34.33,21.51) 34.45,21.39 34.45,19.97 33.44,18.95 33.44,18.67 29.5,14.73 18.14,14.73 17.93,14.52 v1(17.45,14.52)
LCD_D23: length 24.7
  Top Layer w0.2: v1(17.4,13.56) 17.48,13.64 U8.4 ; U1.6 34.84,20.41 34.84,21.8 v1(34.97,21.93)
  Bottom Layer w0.2: v1(34.97,21.93) 34.84,21.8 34.84,19.93 33.74,18.83 33.74,18.54 29.62,14.42 18.26,14.42 18,14.16 18,14.15 v1(17.4,13.56)
LCD_DE: length 17.3
  Top Layer w0.2: v1(10.53,21.85) 10.53,21.3 U8.33 ; U1.36 24.05,17.81 v1(24.06,17.8)
  Bottom Layer w0.2: v1(24.06,17.8) 24.05,17.79 17.91,17.79 17.31,18.39 13.1,18.39 10.53,20.96 v1(10.53,21.85)
LCD_HSYNC: length 18.7
  Top Layer w0.2: U1.35 23.8,18.21 23.86,18.28 24.26,18.28 24.54,18 24.54,17.44 v1(24.55,17.43) ; v1(10.14,20.68) 10.03,20.79 U8.34
  Bottom Layer w0.2: v1(10.14,20.68) 10.14,20.65 12.83,17.96 17.14,17.96 17.78,17.32 24.43,17.32 v1(24.55,17.43)
LCD_SCK: length 26.4
  Top Layer w0.2: v2(16.81,12.6) 17.25,12.17 18.16,12.17 U8.1 18.78,12.14 R19.1 ; v1(35.05,18.44) 34.65,18.44 33.64,19.45 U1.9
  Bottom Layer w0.2: v1(35.05,18.44) 34.49,18.44 29.87,13.82 19.34,13.82 17.69,12.17 17.25,12.17 v2(16.81,12.6)
LCD_SDA: length 23.2
  Top Layer w0.2: v1(34.67,19.09) 34.61,19.09 34.04,19.66 U1.8 ; v2(17.43,12.62) 18.16,12.62 U8.2 19.06,12.64 R20.1
  Bottom Layer w0.2: v1(34.67,19.09) 34.67,19.05 29.75,14.12 18.91,14.12 17.43,12.64 v2(17.43,12.62)
LCD_VSYNC: length 21.1
  Top Layer w0.2: U1.34 24.37,18.61 v1(25.13,17.85) ; v1(9.54,20.46) 9.53,20.47 U8.35
  Bottom Layer w0.2: v1(25.13,17.85) 25.13,17.16 24.9,16.93 17.59,16.93 16.97,17.55 12.6,17.55 9.68,20.46 v1(9.54,20.46)
MCSI-CKN: length 42.1
  Top Layer w0.108: P1.8 4.33,13.75 4.21,13.88 3.71,13.88 3.54,13.7 v1(3.27,13.7) ; U1.87 33.24,6.01 33.17,6.08 33.17,8.5 33.28,8.61 33.28,8.76 v1(33.34,8.83)
  SIG w0.108: v1(33.34,8.83) 33.34,8.56 33.2,8.42 33.2,8.08 33.01,7.89 32.43,7.89 32.15,8.17 32.15,9.01 30.64,10.52 27.95,10.52 arc(27.72,10.42) 27.62,10.19 arc(27.45,9.77) 27.03,9.6 26.99,9.6 arc(26.58,9.77) 26.4,10.19 arc(26.31,10.42) 26.07,10.52 25.99,10.52 arc(25.77,10.43) 25.68,10.21 arc(25.51,9.81) 25.11,9.64 25.03,9.64 arc(24.63,9.81) 24.46,10.21 arc(24.37,10.43) 24.16,10.52 17.89,10.52 13.97,14.44 6.35,14.44 5.79,13.88 3.71,13.88 3.54,13.7 v1(3.27,13.7)
MCSI-CKP: length 41.6
  Top Layer w0.108: v1(3.27,14.31) 3.54,14.31 3.71,14.13 4.21,14.13 4.33,14.25 P1.9 ; v1(32.74,8.83) 32.91,8.66 32.91,6.08 32.84,6.01 U1.86
  SIG w0.108: v1(3.27,14.31) 3.54,14.31 3.71,14.13 5.69,14.13 6.25,14.7 14.07,14.7 17.99,10.78 24.16,10.78 arc(24.56,10.61) 24.72,10.21 arc(24.81,9.99) 25.03,9.9 25.11,9.9 arc(25.33,9.99) 25.42,10.21 arc(25.59,10.61) 25.99,10.78 26.07,10.78 arc(26.49,10.6) 26.66,10.19 arc(26.76,9.95) 26.99,9.85 27.03,9.85 arc(27.26,9.95) 27.36,10.19 arc(27.53,10.6) 27.95,10.78 30.74,10.78 32.41,9.11 32.41,8.28 32.53,8.15 32.91,8.15 32.91,8.16 32.91,8.39 32.74,8.56 v1(32.74,8.83)
MCSI-D0N: length 41.9
  Top Layer w0.108: v1(6.12,10.7) 6.07,10.75 P1.2
  Top Layer w0.123: U1.82 31.24,4.29 31.33,4.2 31.33,2.67 30.91,2.25 30.91,2.25 30.41,1.76 29.85,1.76 29.68,1.59 v1(29.4,1.59)
  SIG w0.108: v1(29.4,1.59) 29.13,1.59 28.96,1.76 28.7,1.76 arc(28.57,1.71) 28.52,1.59 arc(28.39,1.28) 28.09,1.15 27.74,1.15 arc(27.43,1.28) 27.31,1.59 27.31,2.15 arc(27.27,2.24) 27.18,2.28 26.73,2.28 arc(26.64,2.24) 26.61,2.15 26.61,1.59 arc(26.48,1.28) 26.17,1.15 25.83,1.15 arc(25.52,1.28) 25.39,1.59 25.39,2.2 arc(25.34,2.33) 25.21,2.38 24.87,2.38 arc(24.74,2.33) 24.69,2.2 24.69,1.59 arc(24.56,1.28) 24.25,1.15 23.91,1.15 arc(23.6,1.28) 23.47,1.59 23.47,2.15 arc(23.44,2.24) 23.35,2.28 22.9,2.28 arc(22.81,2.24) 22.77,2.15 22.77,1.59 arc(22.65,1.28) 22.34,1.15 21.99,1.15 arc(21.69,1.28) 21.56,1.59 21.56,2.2 arc(21.51,2.33) 21.38,2.38 21.04,2.38 arc(20.91,2.33) 20.86,2.2 arc(20.73,1.89) 20.42,1.76 19.3,1.76 15.18,5.88 9.57,5.88 8.66,6.8 8.66,9.55 7.34,10.88 6.57,10.88 6.39,10.7 v1(6.12,10.7)
MCSI-D0P: length 41.5
  Top Layer w0.108: P1.3 6.07,11.25 v1(6.12,11.31)
  Top Layer w0.123: U1.81 30.84,4.4 30.9,4.34 30.9,4.24 31.06,4.09 31.06,2.78 30.8,2.53 30.8,2.53 30.3,2.03 29.85,2.03 29.68,2.19 v1(29.4,2.19)
  SIG w0.108: v1(6.12,11.31) 6.39,11.31 6.57,11.13 7.44,11.13 8.92,9.66 8.92,6.9 9.68,6.14 15.29,6.14 19.41,2.02 20.42,2.02 arc(20.55,2.07) 20.6,2.2 arc(20.73,2.51) 21.04,2.64 21.38,2.64 arc(21.69,2.51) 21.82,2.2 21.82,1.59 arc(21.87,1.46) 21.99,1.41 22.34,1.41 arc(22.46,1.46) 22.52,1.59 22.52,2.15 arc(22.63,2.42) 22.9,2.53 23.35,2.53 arc(23.62,2.42) 23.73,2.15 23.73,1.59 arc(23.78,1.46) 23.91,1.41 24.25,1.41 arc(24.38,1.46) 24.43,1.59 24.43,2.2 arc(24.56,2.51) 24.87,2.64 25.21,2.64 arc(25.52,2.51) 25.65,2.2 25.65,1.59 arc(25.7,1.46) 25.83,1.41 26.17,1.41 arc(26.3,1.46) 26.35,1.59 26.35,2.15 arc(26.46,2.42) 26.73,2.53 27.18,2.53 arc(27.45,2.42) 27.56,2.15 27.56,1.59 arc(27.62,1.46) 27.74,1.41 28.09,1.41 arc(28.21,1.46) 28.26,1.59 arc(28.39,1.89) 28.7,2.02 28.96,2.02 29.13,2.19 v1(29.4,2.19)
MCSI-D1N: length 40.5
  Top Layer w0.108: P1.5 4.33,12.25 4.21,12.38 3.73,12.38 3.56,12.2 v1(3.28,12.2) ; v1(32.14,7.27) 32.14,7 31.97,6.83 31.97,6.08 32.04,6.01 U1.84
  SIG w0.108: v1(32.14,7.27) 32.14,6.94 31.97,6.77 31.97,6.55 31.74,6.32 30.97,6.32 30.65,6.65 24.71,6.65 23.01,4.95 17.45,4.95 15.83,6.57 15.83,10.26 12.89,13.2 6.35,13.2 5.56,12.42 3.77,12.42 3.56,12.2 v1(3.28,12.2)
MCSI-D1P: length 40.1
  Top Layer w0.108: v1(3.28,12.81) 3.56,12.81 3.73,12.63 4.21,12.63 4.33,12.75 P1.6 ; U1.83 31.64,6.01 31.71,6.08 31.71,6.83 31.54,7 v1(31.54,7.27)
  SIG w0.108: v1(31.54,7.27) 31.54,6.94 31.71,6.77 31.71,6.66 31.63,6.58 31.08,6.58 30.76,6.91 24.61,6.91 22.91,5.21 17.56,5.21 16.09,6.68 16.09,10.37 12.99,13.46 6.24,13.46 5.45,12.67 3.69,12.67 3.56,12.81 v1(3.28,12.81)
PWM0: length 18.6
  Top Layer w0.15: 28.09,16.42 26.68,15.01 U1.43
  SIG w0.15: v1(28.09,16.49) 28.56,16.96 31.81,16.96 33.6,18.74 33.6,25.17 H1.21
PWM1: length 22.6
  Top Layer w0.15: 28.81,16.42 27,14.61 U1.44
  SIG w0.15: v1(28.81,16.49) 31.7,16.49 33.85,18.64 33.85,22.1 34.99,23.24 34.99,26.44 H1.22
RTC_RST: length 2.3
  Top Layer w0.15: v1(40.33,8) 39.81,7.48 39.01,7.48 38.94,7.41 U1.99
SDC0_CLK: length 21.9
  Top Layer w0.2: U1.105 35.57,9.81 v1(35.49,9.89) ; R18.2 D5.6 D5.5 48.62,16.87 48.29,16.54 v1(47.26,16.54)
  Bottom Layer w0.15: v1(35.49,9.89) 35.49,11.23 40.72,16.46 47.18,16.46 v1(47.26,16.54)
SDC0_CMD: length 35.2
  Top Layer w0.2: U1.103 36.88,9.01 36.84,9.05 ; v1(61.62,17.27) 61.53,17.37 D5.7 D5.4 47.6,17.37
  Bottom Layer w0.15: v1(36.88,9.05) 35.58,9.05 35.01,9.62 35.01,12.62 39.81,17.42 47.55,17.42 47.6,17.37
  vias: v1(47.72,17.37)
SDC0_D0: length 30
  Top Layer w0.2: v1(61.62,12.87) 58.03,12.87 56.89,14.01 49.33,14.01 D7.1 v1(47.62,14.02) ; v1(36.22,10.4) 36.41,10.21 U1.106
  Bottom Layer w0.15: v1(36.22,10.4) 36.22,11.3 37.93,13.01 46.61,13.01 v1(47.62,14.02)
SDC0_D1: length 28.3
  Top Layer w0.2: U1.107 37.14,10.61 v1(36.89,10.86) ; v1(61.62,11.79) 58.43,11.79 56.7,13.52 D7.9 D7.2 48.06,13.52 v1(48.02,13.48)
  Bottom Layer w0.15: v1(48.02,13.48) 47.16,12.62 38.21,12.62 36.89,11.3 v1(36.89,10.86)
SDC0_D2: length 38.4
  Top Layer w0.2: U1.101 37.26,8.21 37.03,7.98 35.44,7.98 v1(35.07,8.35) ; v1(47.72,18.88) 48.11,18.88 48.12,18.89 R13.1 48.55,18.9 60.51,18.9 61.03,19.42 61.47,19.42 61.52,19.47 v1(61.62,19.47)
  Bottom Layer w0.15: v1(47.72,18.88) 47.69,18.85 40.5,18.85 34.12,12.48 34.12,9.24 35.01,8.35 v1(35.07,8.35)
